# Altium project Hope Badge.PrjPcb
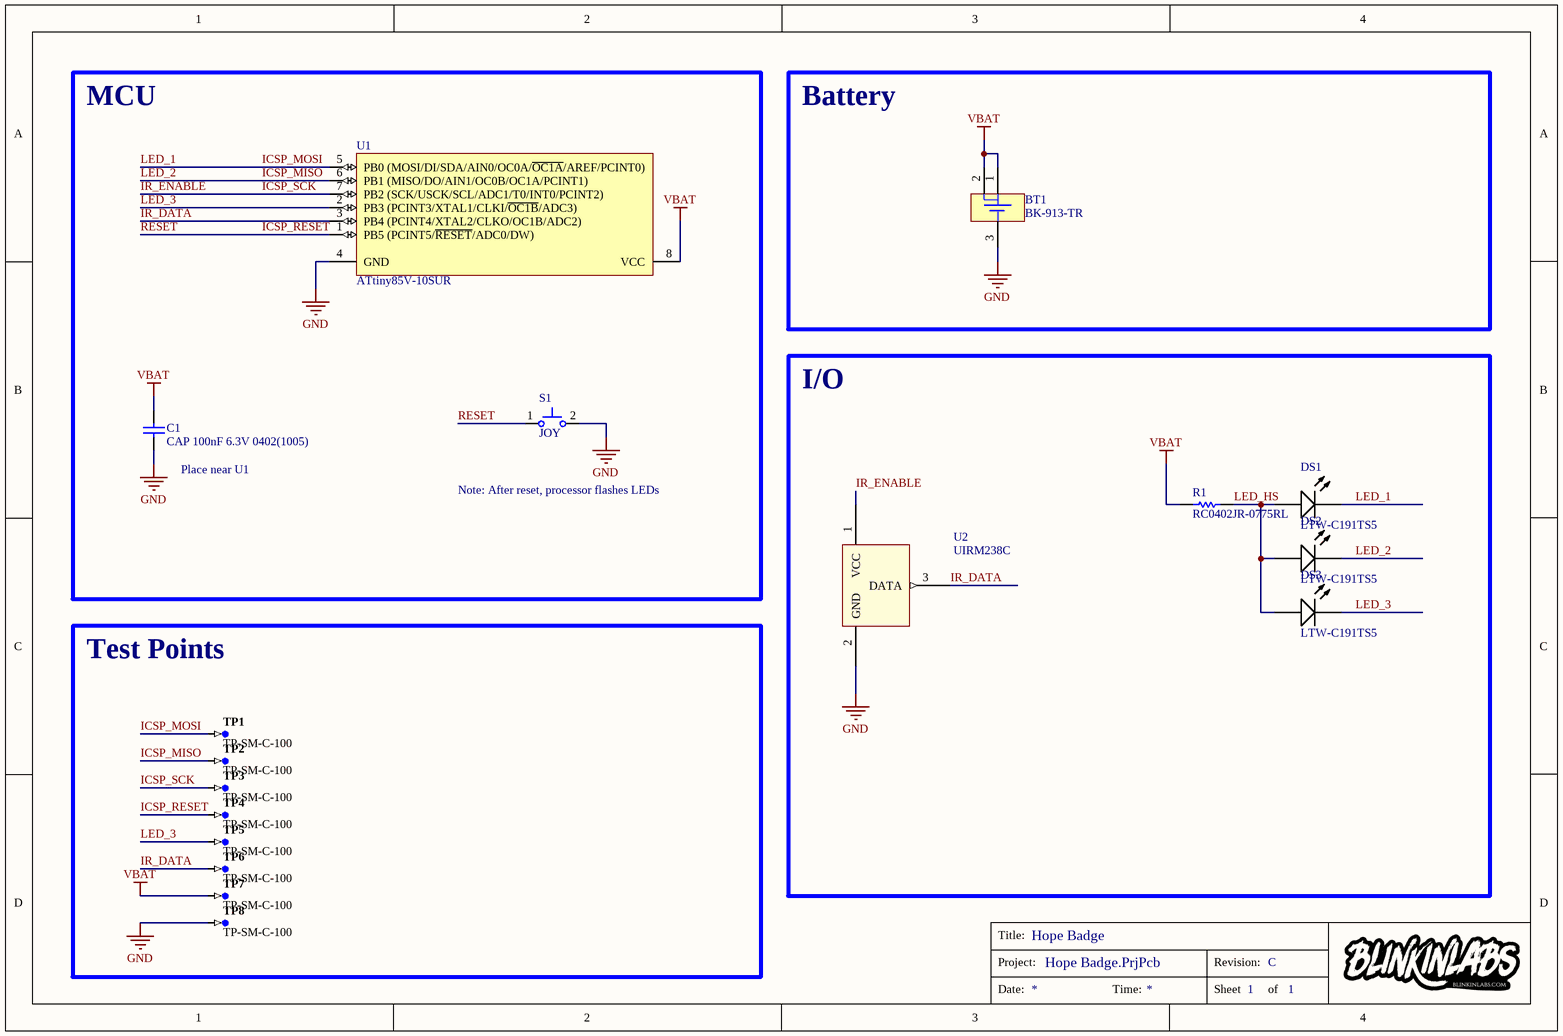
[diagram p0: Hope Badge.SchDoc]
1 sheet, 17 parts. Net scope: global (net labels, ports and power ports of the same name join across sheets).
Board file: Hope Badge.PcbDoc

## Sheet Hope Badge.SchDoc: Hope Badge
size A4; Revision: C; SheetNumber: 1; SheetTotal: 1

### Parts
BT1  BK-913-TR  [MPD-BK-913-3_V]
C1  CAP 100nF 6.3V 0402(1005)  [CAPC0402(1005)60_N]
DS1  LTW-C191TS5  [LTST-LTW-C191TS5_V]
DS2  LTW-C191TS5  [LTST-LTW-C191TS5_V]
DS3  LTW-C191TS5  [LTST-LTW-C191TS5_V]
R1  RC0402JR-0775RL  [RESC1005X40X25ML5T10]
S1  JOY  [TS-1185]
TP1  TP-SM-C-100  [TP-SM-C-100]  (no BOM)
TP2  TP-SM-C-100  [TP-SM-C-100]  (no BOM)
TP3  TP-SM-C-100  [TP-SM-C-100]  (no BOM)
TP4  TP-SM-C-100  [TP-SM-C-100]  (no BOM)
TP5  TP-SM-C-100  [TP-SM-C-100]  (no BOM)
TP6  TP-SM-C-100  [TP-SM-C-100]  (no BOM)
TP7  TP-SM-C-100  [TP-SM-C-100]  (no BOM)
TP8  TP-SM-C-100  [TP-SM-C-100]  (no BOM)
U1  ATtiny85V-10SUR  [8S2_M]
U2  UIRM238C  [UIRM238C]

### Blocks framed on the sheet
MCU: C1 S1 U1
Battery: BT1
I/O: DS1-DS3 R1 U2
Test Points: TP1-TP8

### Nets
GND: BT1.3(NEGATIVE) C1.1 S1.2 TP8.1 U1.4(GND) U2.2(GND)
VBAT: BT1.1(POSITIVE) BT1.2(POSITIVE) C1.2 R1.2 TP7.1 U1.8(VCC)
ICSP_MISO: DS2.2(K) TP2.1 U1.6(PB1_(MISO/DO/AIN1/OC0B/OC1A/PCINT1))  [also labelled LED_2]
ICSP_MOSI: DS1.2(K) TP1.1 U1.5(PB0_(MOSI/DI/SDA/AIN0/OC0A/~{OC1A}/AREF/PCINT0))  [also labelled LED_1]
ICSP_RESET: S1.1 TP4.1 U1.1(PB5_(PCINT5/~{RESET}/ADC0/DW))  [also labelled RESET]
ICSP_SCK: TP3.1 U1.7(PB2_(SCK/USCK/SCL/ADC1/T0/INT0/PCINT2)) U2.1(VCC)  [also labelled IR_ENABLE]
IR_DATA: TP6.1 U1.3(PB4_(PCINT4/XTAL2/CLKO/OC1B/ADC2)) U2.3(DATA)
LED_3: DS3.2(K) TP5.1 U1.2(PB3_(PCINT3/XTAL1/CLKI/~{OC1B}/ADC3))
LED_HS: DS1.1(A) DS2.1(A) DS3.1(A) R1.1

### Notes on the sheet
- (near C1) Place near U1
- Note: After reset, processor flashes LEDs
- Title:
- Project:
- Revision:
- Date:
- Time:
- Sheet
- of

### Library data of the parts
BT1 = CMP-0460-00001-1: Battery Retainer for 20 mm Dia. Batteries, RoHS, Bag; Manufacturer: Memory Protection Devices; Battery Series: 2032; Battery Type, Function: Coin Cell, Retainer; Number of Cells: 1; PartNumber: BK-913-TR; Packing: Bag; PackageDescription: 3-Pin Through Hole Retainer, Body 21.08 x 15.24 mm, Height 4.27 mm; Mounting Technology: Through Hole; ComponentLink2Description: Datasheet; PackageReference: BK-913-3; Category: Battery Products; ComponentLink3Description: Package Specification; Family: Battery Holders, Clips, Contacts; ComponentLink2URL: http://www.memoryprotectiondevices.com/datasheets/BK-913-datasheet.pdf; RoHS: TRUE; ComponentLink3URL: http://www.memoryprotectiondevices.com/datasheets/BK-913-datasheet.pdf; PackageVersion: May-10; ComponentLink1Description: Manufacturer URL; ComponentLink1URL: http://www.memoryprotectiondevices.com/; DatasheetVersion: May-10
C1 = CMP-1034-02063-1: CAP 100nF 6.3V -20% to +80% 0402 (1005 Metric) Thickness 0.6mm SMD; Case-EIA: 0402; Case-Metric: 1005; Tolerance: -20% to +80%; Max Thickness: 0.6 mm; Value: 100nF; Technology: SMT; Rated Voltage: 6.3 V
DS1-DS3 = CMP-1674-00013-1: LED Uni-Color White, 70 mW, 20 mA, -20 to 80 degC, 2-Pin SMD, RoHS, Tape and Reel; Case\Package: 0603; Power Rating: 100 mW; Voltage Rating: 50 V; Tolerance: 1%; Resistance: 12 Ohm; Min Operating Temperature: -55 degC; Mount: Surface Mount; Pins: 2; Case Code (Imperial): 0603; PackageReference: LTW-C191TS5; ComponentLink2URL: http://optoelectronics.liteon.com/upload/download/DS22-2004-201/S_110_LTW-C191TS5.pdf; REACH SVHC: No SVHC; Max Operating Temperature: 155 degC; DatasheetVersion: Rev. B, 06/2010; Packaging: Tape and Reel; RoHSCompliant: true; Height: 0.45 mm; Length: 1.6 mm; Width: 0.8 mm; Voltage Rating (DC): 50 V; ComponentLink1URL: http://www.us.liteon.com/; PackageDescription: 2-Pin Surface Mount Device, Body 1.6 x 0.8 mm; ComponentLink1Description: Manufacturer URL; Case Code (Metric): 1608; Package Quantity: 5000; ComponentLink2Description: Datasheet
R1 = CMP-2002-08044-2: Chip Resistor, 75 Ohm, +/- 5%, 0.063 W, -55 to 155 degC, 0402 (1005 Metric), RoHS, Tape and Reel; Resistance: 75 Ohm; Voltage Rating: 50 V; Power Rating: 62.5 mW; DatasheetVersion: Rev. 4, 02/2016; ComponentLink2URL: http://www.yageo.com/documents/recent/PYu-RC_Group_51_RoHS_L_04.pdf; Mount: Surface Mount; REACH SVHC: No SVHC; Package Quantity: 200; ComponentLink1URL: http://www.yageo.com/; Tolerance: 5%; Case Code (Metric): 1005; Case Code (Imperial): 0402; RoHSCompliant: true; PackageDescription: 2-Pin Surface Mount Device, Body 1 x 0.5 mm; Min Operating Temperature: -55 degC; Case/Package: 0402; ComponentLink2Description: Datasheet; Mounting Technology: Surface Mount; PartNumber: RC0402JR-0775RL; Max Operating Temperature: 155 degC; Length: 1 mm; ComponentLink1Description: Manufacturer URL; Width: 0.5 mm; Packaging: Tape and Reel; Height: 0.35 mm; Radiation Hardening: No
S1 = TS-1185: Tact Switch, 3x4mm, no alignment pin, turtle style
TP1-TP8 = CMP-0484-00002-2: Test Point, Surface Mount, Circular, Pad Diameter 1 mm; Manufacturer: No Vendor; PartNumber: TP-SM-C-100
U1 = CMP-0093-00335-1: 8-bit AVR Microcontroller, 10MHz, 1.8-5.5V, 8K Flash, 512 Bytes EEPROM, 512 Bytes SRAM, Industrial Grade (-40°C to 85°C), 8-Lead SOIC, Pb-Free, Reel; ComponentLink1URL: http://www.atmel.com/; ComponentLink1Description: Manufacturer URL; ComponentLink2URL: http://www.atmel.com/dyn/resources/prod_documents/doc2586.pdf; ComponentLink3URL: http://www.atmel.com/dyn/resources/prod_documents/2586S.pdf; ComponentLink2Description: ATtiny25/45/85 Datasheet; PackageVersion: revF, Apr-2008; ComponentLink3Description: ATtiny25/45/85 Summary; DatasheetVersion: revN, Apr-2011; PackageReference: 8S2
U2 = UIRM238C: Infrared Receiver Module